# Altium schematic sheet EMI_Filter.SchDoc: EMI Filter
size A3; SheetNumber: 1; SheetTotal: 3
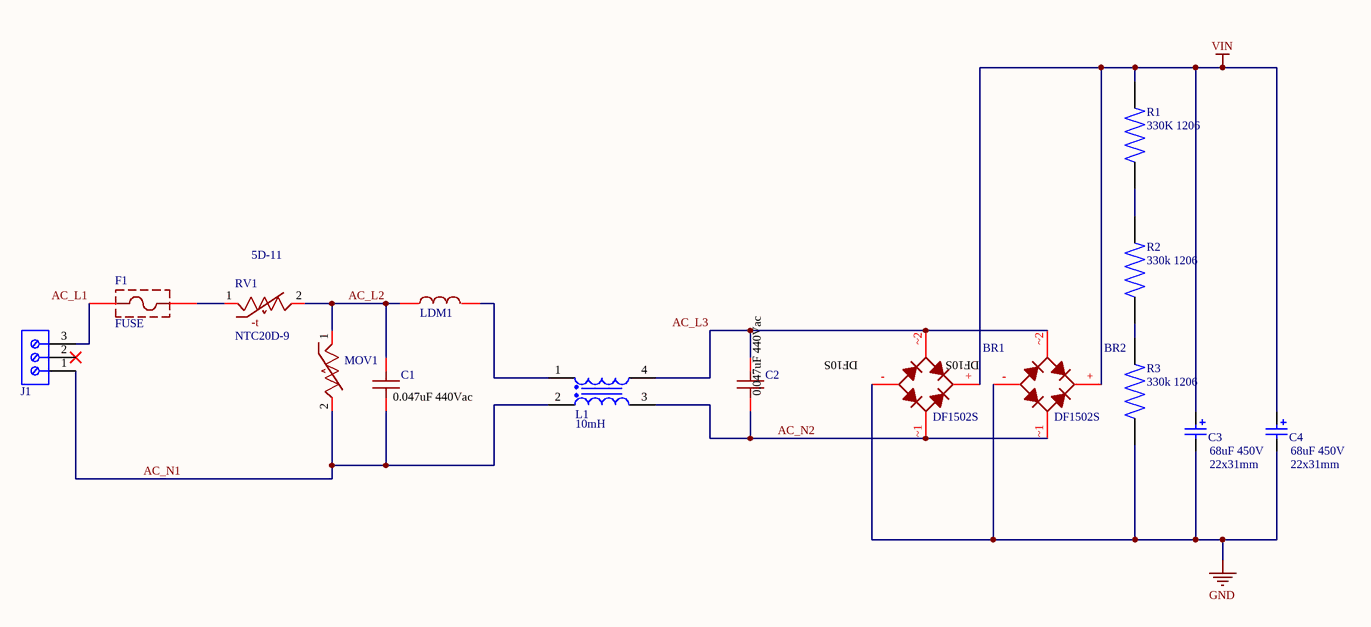
[diagram p0: EMI_Filter.SchDoc]

## Parts
BR1  DBLS208GH  [DB SMD]  (value not drawn)
BR2  DBLS208GH  [DB SMD]  (value not drawn)
C1  Parameter 1: 0.047uF 440Vac  [R474I2470CKA2M]  (hidden comment: R474I2470CKA2M)
C2  Parameter 1: 0.047uF 440Vac  [R474I2470CKA2M]  (hidden comment: R474I2470CKA2M)
C3  82uF  [WCAP-AI3H_D22H30]  (value not drawn)
C4  82uF  [WCAP-AI3H_D22H30]  (value not drawn)
F1  FUSE  [FUSE]
J1  16A, 300V  [691213710003]  (value not drawn)
L1  10mH  [WE-FC_ET20H]
LDM1  SN5-300  [SN5300]  (value not drawn)
MOV1  MOV-14D751K  [B72214S2271K101]  (value not drawn)
R1  330K 1206  [RESC3116X65N]
R2  330k 1206  [RESC3116X65N]
R3  330k 1206  [RESC3116X65N]
RV1  NTC20D-9  [NTC20D9]

## Nets
GND: BR1.- BR2.- C3.2(N) C4.2(N) R3.1
VIN: BR1.+ BR2.+ C3.1(P) C4.1(P) R1.2
AC_L1: F1.1 J1.3
AC_L2: C1.1 LDM1.1 MOV1.1 RV1.2
AC_L3: BR1.~2 BR2.~2 C2.1 L1.4
AC_N1: C1.2 J1.1 L1.2 MOV1.2
AC_N2: BR1.~1 BR2.~1 C2.2 L1.3
NetF1_2: F1.2 RV1.1
NetL1_1: L1.1 LDM1.2
NetR1_1: R1.1 R2.2
NetR2_1: R2.1 R3.2

Not connected (* = marked no-connect by the designer): J1 2*

## Notes on the sheet
- (near RV1) 5D-11
- (near BR1) DF1502S
- (near BR2) DF1502S
- 68uF 450V
- 22x31mm
- (near C4) 68uF 450V
- (near C4) 22x31mm
- Project:
- XEVTECH COMPANY LIMITED
- Address: C17, Khu Barya City
- Drawn by:
- Size:
- A3
- Sheet
- of
- Date:
- TP Bà Rịa, Tỉnh Bà Rịa Vũng Tàu
- Email: admin@xevtech.vn
- Phone: 090 172 8898
- (in symbol BRIDGE RECT 1.2KV 2A) DF10S
- (in symbol NTC20D-9) -t

## Library data of the parts
BR1 BR2 = BRIDGE RECT 1.2KV 2A: Bridge Rectifier Single Phase Standard 1.2 kV Surface Mount DBLS; Manufacturer: FairchildSemiconductor; Peak Average Forward Current: 1.5@Ta=40CA; Peak Reverse Repetitive Voltage: 1000V; Peak Reverse Current: 5uA; Peak Forward Voltage: 1.1@1AV; Supplier 1: Digikey; Supplier Part Number 1: 1801-DBLS158GCT-ND; Datasheet Version: Rev. 1.5, 05/2015; Package: 4SDIPSMD; Operating Temperature: -55to150°C; Configuration: Single; Package Reference: SDIP 4L; Datasheet URL: http://www.farnell.com/datasheets/1941063.pdf; Packaging: Tape&Reel; Manufacturer URL: https://www.fairchildsemi.com/; Bridge Type: SinglePhase; Mounting Technology: SurfaceMount; Category: BridgeRectifier; Package Description: 4-Pin Surface Mount Device, Body 8.28 x 6.35 mm, Pitch 5.1 mm; Mounting: SurfaceMount
C1 C2 = R474I2470CKA2M: 0.047 µF Film Capacitor 440V 1000V (1kV) Polypropylene (PP), Metallized Radial; Manufacturer 1: KEMET; Description 1: Cap Film 0.047UF 20% 1KVDC Rad; Category 1: Film Capacitors; Capacitance: 47nF; Tolerance: 20%; Ratings: AEC-Q200,X1; Supplier 1: Digikey; Supplier Part Number 1: 399-17231-1-ND; Manufacturer Part Number 1: R474I2470CKA2M; RoHS 1: Yes; Stock 1: 4929; Pricing 1: 1=0,69, 10=0,482, 50=0,4056, 100=0,3302, 500=0,27518 (USD); ComponentLink1URL: https://datasheet.ciiva.com/46436/1848873-46436253.pdf?src-supplier=Element14; ComponentLink1Description: https://datasheet.ciiva.com/46436/1848873-46436253.pdf?src-supplier=Element14; Mount: Through Hole; Case/Package: Radial; Dielectric Material: PP; Min Operating Temperature: -40°C; Max Operating Temperature: 110°C; Series: R47; Packaging: Cut Tape; Voltage Rating (AC): 440V; Voltage Rating (DC): 1kV; Termination: PC Pins; RoHS Compliant: Yes
C3 C4 = 861141483002: WCAP-AI3H Aluminum Electrolytic Capacitor, Snap-In, D22xH30mm, 82uF, 450V; Manufacturer: Wurth Elektronik; Capacitance Tolerance: +/-20%; Dissipation Factor: 20%; Endurance: 3000h; Leakage Current: 576.28uA; Ripple Current: 640mA; Technical Reference: ANJN300820M450DSIC3C000; ComponentLink1Description: Manufacturer Link; ComponentLink1URL: https://www.we-online.com/redexpert/article/861141483002?ad; ComponentLink2Description: Datasheet; ComponentLink2URL: https://www.we-online.com/redexpert/spec/861141483002?ad; Category: Aluminum Electrolytic Capacitors; Match Code: WCAP-AI3H; Manufacturer Part Number: 861141483002; Mount: Through Hole; Operating Temperature Max: 105°C; Operating Temperature Min: -25°C; Packaging: Tray; Height: 30mm; Diameter: 22mm; Capacitance: 82uF; Rated Voltage (DC): 450V
F1 = FUSE: 2 A 250 V AC 125 V DC Fuse Board Mount (Cartridge Style); Manufacturer: Littelfuse; Manufacturer Part Number: 0505025.MXP; RoHS: Yes; Category: Fuses; Stock 1: 3122; Pricing 1: 1=5.43, 5=5.244, 10=5.057, 50=3.9336, 100=3.278, 250=3.18436, 500=2.71606, 1000=2.57558 (USD); ComponentLink1URL: https://datasheet.ciiva.com/26890/getdatasheetpartid-706019-26890404.pdf?src-supplier=Verical; ComponentLink1Description: https://datasheet.ciiva.com/26890/getdatasheetpartid-706019-26890404.pdf?src-supplier=Verical; ComponentLink2URL: https://datasheet.ciiva.com/29618/littelfuse-fuse-505-datasheet-pdf-29618152.pdf?src-supplier=Digi-Key; ComponentLink2Description: https://datasheet.ciiva.com/29618/littelfuse-fuse-505-datasheet-pdf-29618152.pdf?src-supplier=Digi-Key; ComponentLink3URL: https://datasheet.ciiva.com/300/littelfuse-fuse-505-300507.pdf?src-supplier=Digi-Key; ComponentLink3Description: https://datasheet.ciiva.com/300/littelfuse-fuse-505-300507.pdf?src-supplier=Digi-Key; ComponentLink4URL: https://datasheet.ciiva.com/7314/697468-7314411.pdf?src-supplier=Newark; ComponentLink4Description: https://datasheet.ciiva.com/7314/697468-7314411.pdf?src-supplier=Newark
J1 = 691213710003: WR-TBL Series 213 Horizontal Entry Modular, THT, pitch 5mm, 3p; Manufacturer: Wurth Elektronik; Modularity: Yes; Rated Current: 10A; ComponentLink1Description: Datasheet Link; ComponentLink1URL: https://www.we-online.com/redexpert/spec/691213710003?ad; ComponentLink2Description: Supplier 1 URL; ComponentLink2URL: N/A; Manufacturer Part Number: 691213710003; Category: Terminal Blocks; Match Code: WR-TBL; Mount: Through Hole; Operating Temperature Max: 105°C; Operating Temperature Min: -40°C; Packaging: Box; Application: Rising Cage Clamp; Number of Pins: 3; Number of Rows: 1; Orientation: Horizontal; Pitch: 5mm; Working Voltage: 300V; ComponentLink3Description: Supplier 2 URL; ComponentLink3URL: N/A; ComponentLink4Description: Supplier 3 URL; ComponentLink4URL: https://www.thegioiic.com/kf128-3-v-domino-3-chan-thang-5mm-300v-10a-han-pcb-loai-tot; Supplier 1 Name: Mouser; Supplier 1 SN: N/A; Supplier 1 URL: N/A; Supplier 2 Name: Digi-Key; Supplier 2 SN: N/A; Supplier 2 URL: N/A; Supplier 3 Name: thegioiic; Supplier 3 SN: N/A; Supplier 3 URL: https://www.thegioiic.com/kf128-3-v-domino-3-chan-thang-5mm-300v-10a-han-pcb-loai-tot; Value: 16A, 300V
L1 = 7448640399: WE-FC THT Common Mode Power Line Choke, ET20H, 5.9mH, 1.15A, 0.28Ω; Manufacturer: Wurth Elektronik; Insulation Test Voltage (AC): 2000V; Material: MnZn; Rated Voltage (AC): 250V; ComponentLink1Description: Website Link; ComponentLink1URL: https://www.we-online.com/redexpert/article/7448640399?ad; ComponentLink2Description: Datasheet Link; ComponentLink2URL: https://www.we-online.com/redexpert/spec/7448640399?ad; Manufacturer Part Number: 7448640399; Category: Common Mode Chokes; Match Code: WE-FC; Mount: Through Hole; Operating Temperature Max: 125°C; Operating Temperature Min: -40°C; Packaging: Tray; Case/Size Code: ET20H; Length: 21.3mm; Width: 21.3mm; Height: 17.8mm; DC Resistance: 0.28Ω; Inductance: 5.9mH; Rated Current: 1.15A
LDM1 = SN5-300: Filters 25uH 2A DCR=42mOhms; ComponentLink1URL: https://www.allegromicro.com/~/media/Files/Datasheets/ACS72981-Datasheet.ashx?src-supplier=Digi-Key; ComponentLink1Description: https://www.allegromicro.com/~/media/Files/Datasheets/ACS72981-Datasheet.ashx?src-supplier=Digi-Key; Supplier 1: Digikey; Supplier Part Number 1: 399-20548-ND
MOV1 = MOV-14D751K: 750 V 4.5 kA Varistor 1 Circuit Through Hole Disc 14mm; Manufacturer 1: Bourns; Description 1: Var MOV 460VAC/615VDC 4500A 750V Radial Bulk; Category 1: Varistors; Capacitance: 270pF; Voltage Rating (DC): 750V; Max Surge Current: 4.5kA; Current Rating: 50A; Tolerance: 10%; Max Voltage Rating (AC): 460V; Max Voltage Rating (DC): 615V; Clamping Voltage: 1.24kV; Number of Circuits: 1; Energy: 143J; Min Varistor Voltage: 675V; Max Varistor Voltage: 825V; Supplier 1: Digikey; Manufacturer Part Number 1: MOV-14D751K; RoHS 1: Yes; Stock 1: 4415; Pricing 1: 1=0,53, 10=0,458, 400=0,31723, 1200=0,20742, 5200=0,17691, 10000=0,16471 (USD); ComponentLink1URL: https://media.digikey.com/pdf/Data%20Sheets/Bourns%20PDFs/GMOV_Series_DS.pdf?src-supplier=Digi-Key; ComponentLink1Description: https://media.digikey.com/pdf/Data%20Sheets/Bourns%20PDFs/GMOV_Series_DS.pdf?src-supplier=Digi-Key; Supplier Part Number 1: 118-MOV-14D751K-ND; Mount: Radial,Through Hole; Case/Package: Radial; Weight: 0.105822oz; Min Operating Temperature: -40°C; Max Operating Temperature: 85°C; Packaging: Bulk; Package Quantity: 500; Clamping Current: 50A; Varistor Voltage: 750V; Series: -; Diameter: 14mm; Lead Pitch: 7.5mm; Radiation Hardening: No; RoHS Compliant: Yes; ComponentLink2URL: https://datasheet.ciiva.com/3026/mov14d-3026373.pdf?src-supplier=Avnet; ComponentLink2Description: https://datasheet.ciiva.com/3026/mov14d-3026373.pdf?src-supplier=Avnet; ComponentLink3URL: https://datasheet.ciiva.com/369/mov14d-369435.pdf?src-supplier=Digikey; ComponentLink3Description: https://datasheet.ciiva.com/369/mov14d-369435.pdf?src-supplier=Digikey
R1-R3 = RC1206JR-0713RL: 13 Ohms Â±5% 0.25W, 1/4W Chip Resistor 1206 (3216 Metric) Moisture Resistant Thick Film; MF: Yageo; Check_prices: https://www.snapeda.com/parts/RC1206JR-0713RL/Yageo/view-part/?ref=eda; Value: *; Availability: In Stock; MP: RC1206JR-0713RL; Price: None; Package: 3116 Yageo; SnapEDA_Link: https://www.snapeda.com/parts/RC1206JR-0713RL/Yageo/view-part/?ref=snap; Purchase-URL: https://pricing.snapeda.com/search/part/RC1206JR-0713RL/?ref=eda
RV1 = NTC20D-9: NTC Thermistor 20Ohms DIP 1A 25DegC  20R 9MM; MP: B72214S2271K101; MF: EPCOS; Digi-Key_Part_Number: 495-1441-ND; Check_prices: https://www.snapeda.com/parts/B72214S2271K101/EPCOS/view-part/?ref=eda; Package: None; Value: *; SnapEDA_Link: https://www.snapeda.com/parts/B72214S2271K101/EPCOS/view-part/?ref=snap; Purchase-URL: https://pricing.snapeda.com/search/part/B72214S2271K101/?ref=eda